# EAGLE board dev-board1 (EAGLE 9.0.1), part 1 of 2
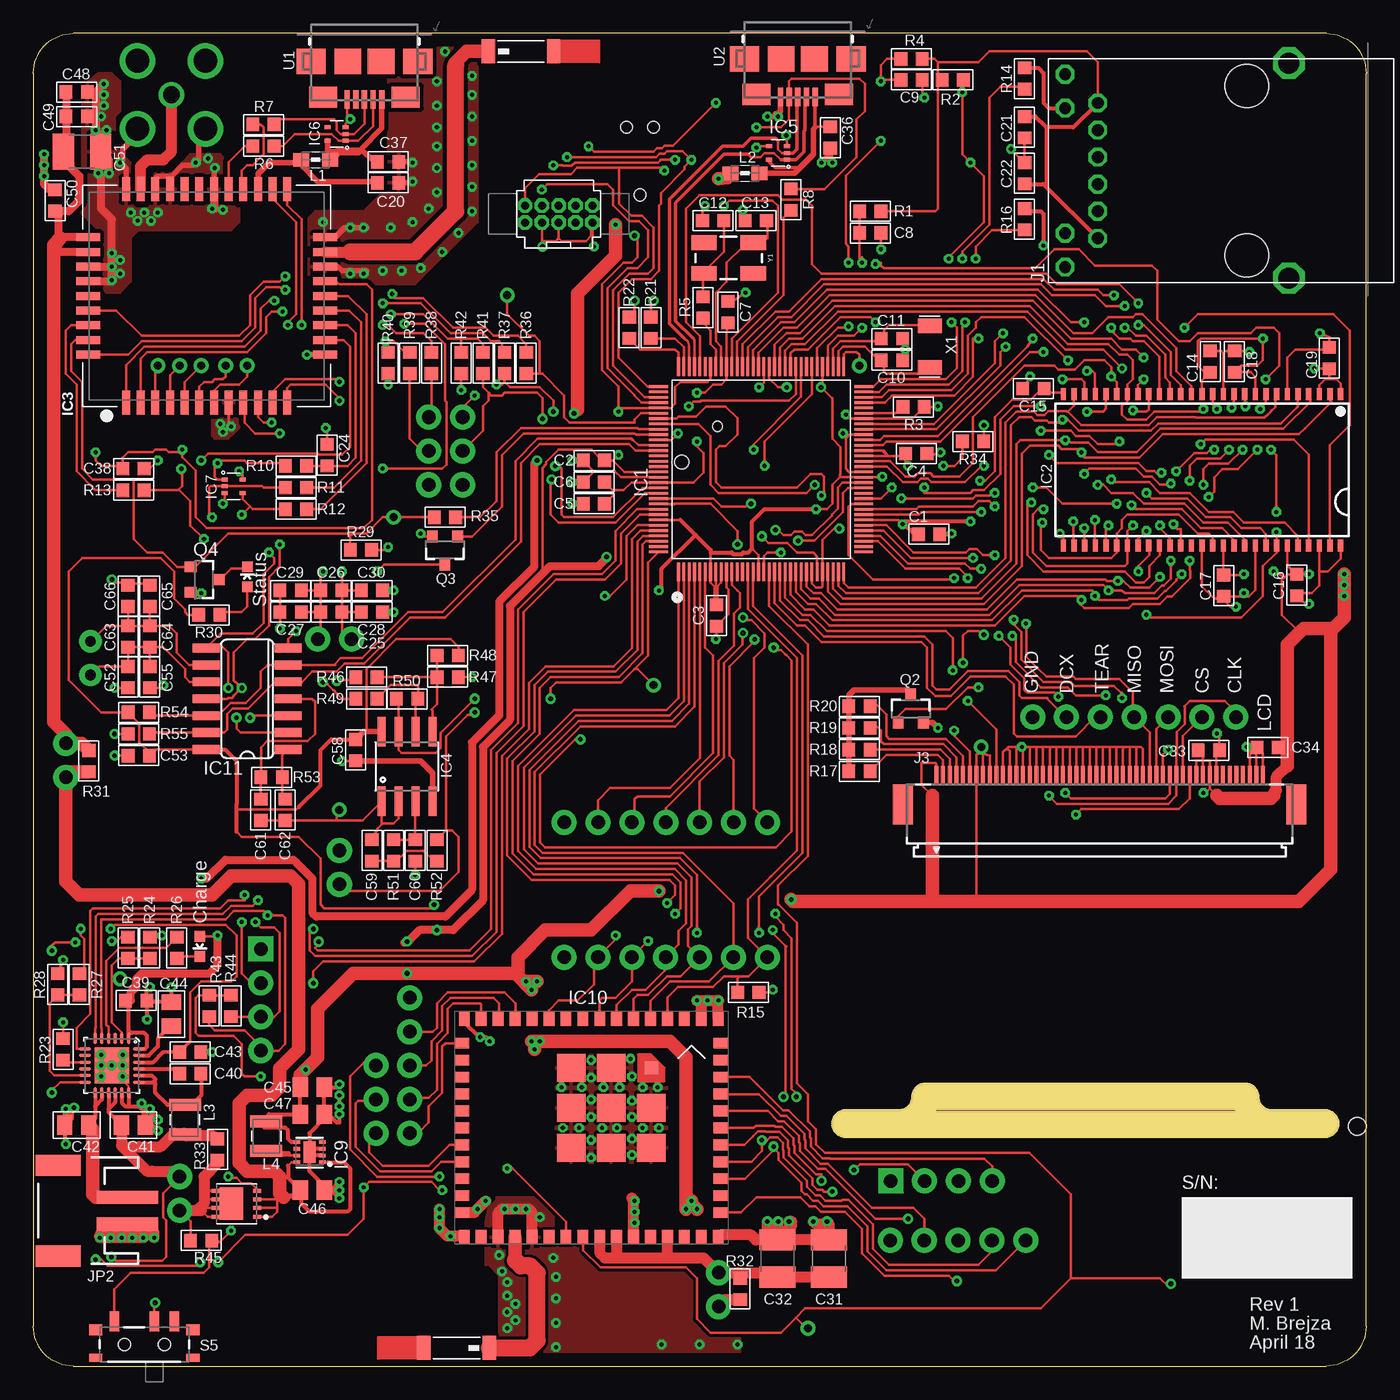
[diagram p3: board, top side]
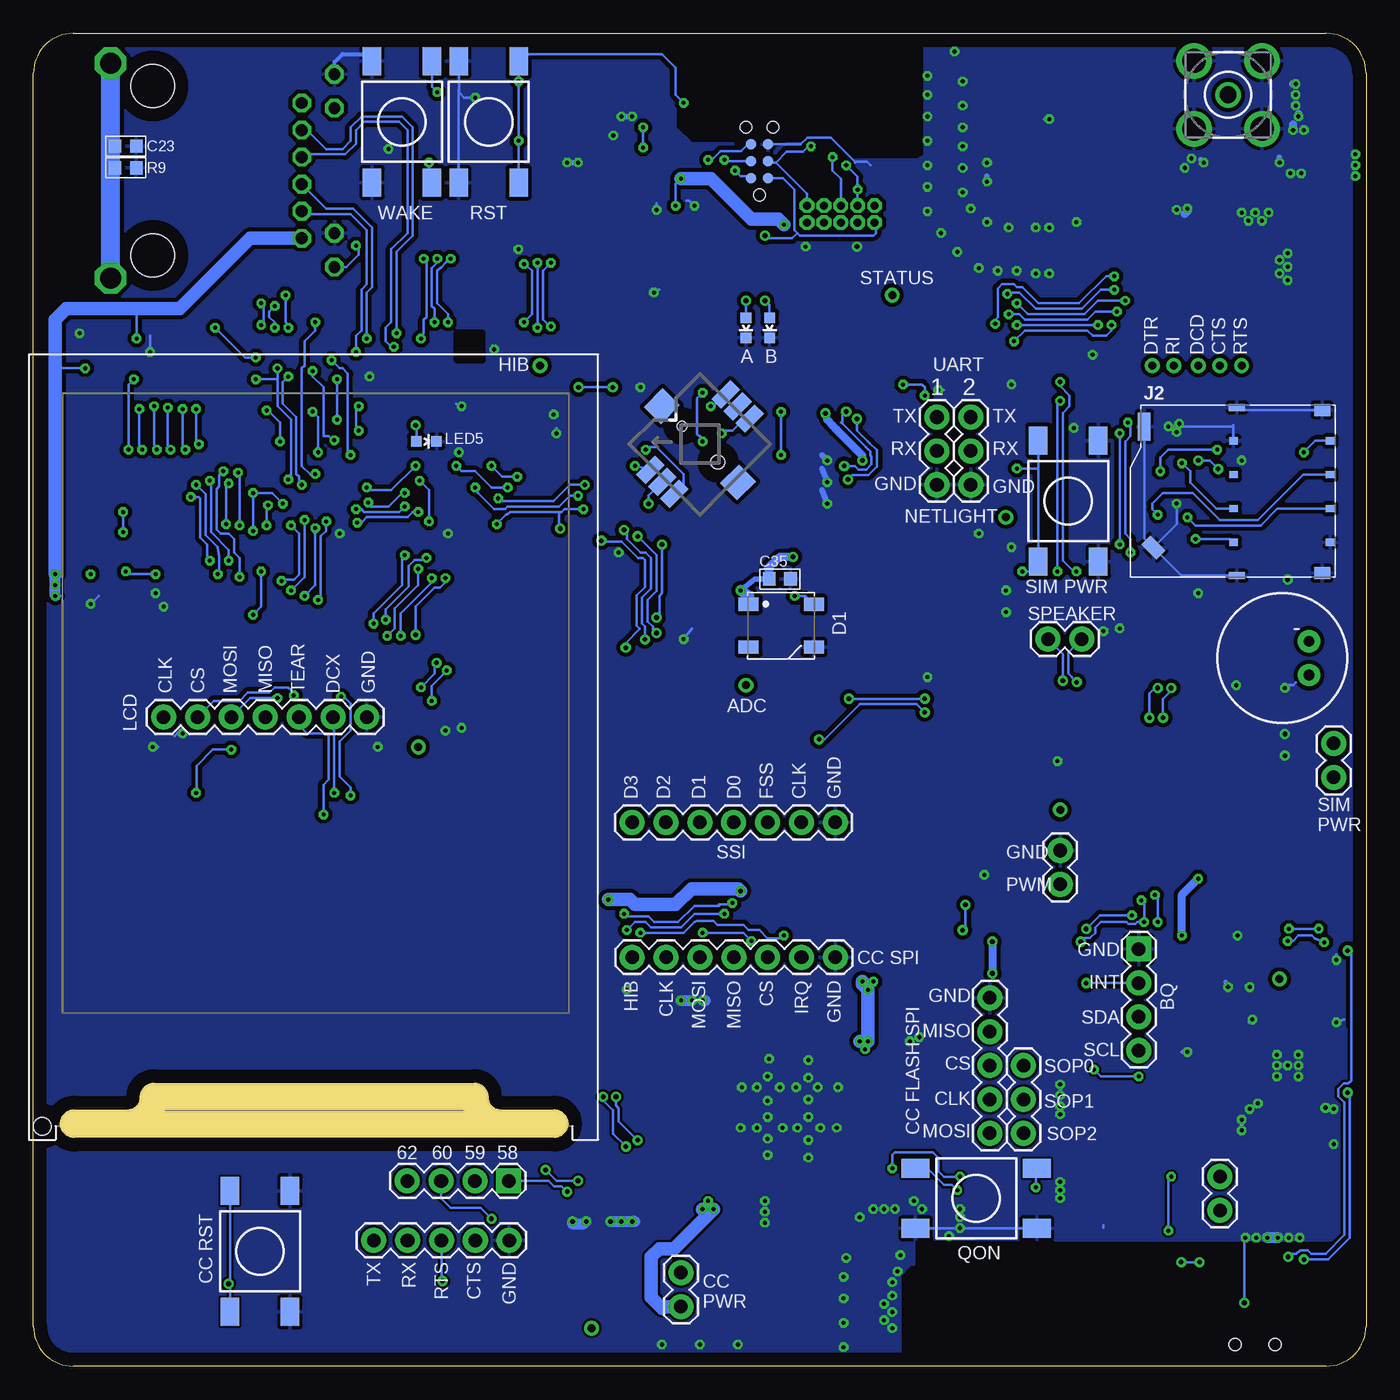
[diagram p4: board, bottom side, seen from below]

Size 100 x 100 mm. Coordinates in mm from the lower left corner, seen from the top.
Outline: 3,0 97,0 arc90 100,3 100,97 arc90 97,100 3,100 arc90 0,97 0,3 arc90 3,0
Copper layers (1*16): Top 0.035mm / dielectric 1.5mm / Bottom 0.035mm
Design rules "default *": minimum track width 7.5mil, minimum drill 12mil, track to track 7mil, track to pad 7mil, pad to pad 6mil, via to via 8mil, smd to smd 0.17271875mm, copper to edge 40mil, drill to drill 8mil, minimum pad ring 10mil, minimum via ring 8mil, stop-mask expansion 4mil, vias tented up to drill 14mil, thermal gap 10mil
Net classes: 0 default: width 0.15 mm, drill 0.3 mm

## Footprints (pad centres in the part's own frame; a part is rotated, then mirrored left to right if it is on the bottom)
2450AT42A100 = smd 1 x 1.8: P$1 -2.45,0; P$2 2.45,0
C0603-N = smd 0.95 x 1: 1 -0.8,0; 2 0.8,0
C1210 = smd 1.6 x 2.7: 1 -1.4,0; 2 1.4,0
C0805-N = smd 1.15 x 1.45: 1 -0.9,0; 2 0.9,0
WS2812B = smd 1.5 x 1: 1 -2.45,1.6; 2 -2.45,-1.6; 3 2.45,-1.6; 4 2.45,1.6
QFP128-0.4 = smd 0.2 x 1.4: 1 -6.2,-7.7; 2 -5.8,-7.7; 3 -5.4,-7.7; 4 -5,-7.7; 5 -4.6,-7.7; 6 -4.2,-7.7; 7 -3.8,-7.7; 8 -3.4,-7.7; 9 -3,-7.7; 10 -2.6,-7.7; 11 -2.2,-7.7; 12 -1.8,-7.7; 13 -1.4,-7.7; 14 -1,-7.7; 15 -0.6,-7.7; 16 -0.2,-7.7; 17 0.2,-7.7; 18 0.6,-7.7; 19 1,-7.7; 20 1.4,-7.7; 21 1.8,-7.7; 22 2.2,-7.7; 23 2.6,-7.7; 24 3,-7.7; 25 3.4,-7.7; 26 3.8,-7.7; 27 4.2,-7.7; 28 4.6,-7.7; 29 5,-7.7; 30 5.4,-7.7; 31 5.8,-7.7; 32 6.2,-7.7; 65 6.2,7.7; 66 5.8,7.7; 67 5.4,7.7; 68 5,7.7; 69 4.6,7.7; 70 4.2,7.7; 71 3.8,7.7; 72 3.4,7.7; 73 3,7.7; 74 2.6,7.7; 75 2.2,7.7; 76 1.8,7.7; 77 1.4,7.7; 78 1,7.7; 79 0.6,7.7; 80 0.2,7.7; 81 -0.2,7.7; 82 -0.6,7.7; 83 -1,7.7; 84 -1.4,7.7; 85 -1.8,7.7; 86 -2.2,7.7; 87 -2.6,7.7; 88 -3,7.7; 89 -3.4,7.7; 90 -3.8,7.7; 91 -4.2,7.7; 92 -4.6,7.7; 93 -5,7.7; 94 -5.4,7.7; 95 -5.8,7.7; 96 -6.2,7.7 | smd 1.4 x 0.2: 33 7.7,-6.2; 34 7.7,-5.8; 35 7.7,-5.4; 36 7.7,-5; 37 7.7,-4.6; 38 7.7,-4.2; 39 7.7,-3.8; 40 7.7,-3.4; 41 7.7,-3; 42 7.7,-2.6; 43 7.7,-2.2; 44 7.7,-1.8; 45 7.7,-1.4; 46 7.7,-1; 47 7.7,-0.6; 48 7.7,-0.2; 49 7.7,0.2; 50 7.7,0.6; 51 7.7,1; 52 7.7,1.4; 53 7.7,1.8; 54 7.7,2.2; 55 7.7,2.6; 56 7.7,3; 57 7.7,3.4; 58 7.7,3.8; 59 7.7,4.2; 60 7.7,4.6; 61 7.7,5; 62 7.7,5.4; 63 7.7,5.8; 64 7.7,6.2; 97 -7.7,6.2; 98 -7.7,5.8; 99 -7.7,5.4; 100 -7.7,5; 101 -7.7,4.6; 102 -7.7,4.2; 103 -7.7,3.8; 104 -7.7,3.4; 105 -7.7,3; 106 -7.7,2.6; 107 -7.7,2.2; 108 -7.7,1.8; 109 -7.7,1.4; 110 -7.7,1; 111 -7.7,0.6; 112 -7.7,0.2; 113 -7.7,-0.2; 114 -7.7,-0.6; 115 -7.7,-1; 116 -7.7,-1.4; 117 -7.7,-1.8; 118 -7.7,-2.2; 119 -7.7,-2.6; 120 -7.7,-3; 121 -7.7,-3.4; 122 -7.7,-3.8; 123 -7.7,-4.2; 124 -7.7,-4.6; 125 -7.7,-5; 126 -7.7,-5.4; 127 -7.7,-5.8; 128 -7.7,-6.2
TSOP54-400 = smd 0.4 x 0.9: 1 -10.4,-5.68; 2 -9.6,-5.68; 3 -8.8,-5.68; 4 -8,-5.68; 5 -7.2,-5.68; 6 -6.4,-5.68; 7 -5.6,-5.68; 8 -4.8,-5.68; 9 -4,-5.68; 10 -3.2,-5.68; 11 -2.4,-5.68; 12 -1.6,-5.68; 13 -0.8,-5.68; 14 0,-5.68; 15 0.8,-5.68; 16 1.6,-5.68; 17 2.4,-5.68; 18 3.2,-5.68; 19 4,-5.68; 20 4.8,-5.68; 21 5.6,-5.68; 22 6.4,-5.68; 23 7.2,-5.68; 24 8,-5.68; 25 8.8,-5.68; 26 9.6,-5.68; 27 10.4,-5.68; 28 10.4,5.68; 29 9.6,5.68; 30 8.8,5.68; 31 8,5.68; 32 7.2,5.68; 33 6.4,5.68; 34 5.6,5.68; 35 4.8,5.68; 36 4,5.68; 37 3.2,5.68; 38 2.4,5.68; 39 1.6,5.68; 40 0.8,5.68; 41 0,5.68; 42 -0.8,5.68; 43 -1.6,5.68; 44 -2.4,5.68; 45 -3.2,5.68; 46 -4,5.68; 47 -4.8,5.68; 48 -5.6,5.68; 49 -6.4,5.68; 50 -7.2,5.68; 51 -8,5.68; 52 -8.8,5.68; 53 -9.6,5.68; 54 -10.4,5.68
SIM800C = smd 1.8 x 0.6: 1 -8,6.05; 2 -8,4.95; 3 -8,3.85; 4 -8,2.75; 5 -8,1.65; 6 -8,0.55; 7 -8,-0.55; 8 -8,-1.65; 9 -8,-2.75; 10 -8,-3.85; 11 -8,-4.95; 12 -8,-6.05; 22 8,-6.05; 23 8,-4.95; 24 8,-3.85; 25 8,-2.75; 26 8,-1.65; 27 8,-0.55; 28 8,0.55; 29 8,1.65; 30 8,2.75; 31 8,3.85; 32 8,4.95; 33 8,6.05 | smd 0.6 x 1.8: 13 -4.4,-8.9; 14 -3.3,-8.9; 15 -2.2,-8.9; 16 -1.1,-8.9; 17 0,-8.9; 18 1.1,-8.9; 19 2.2,-8.9; 20 3.3,-8.9; 21 4.4,-8.9; 34 4.4,8.9; 35 3.3,8.9; 36 2.2,8.9; 37 1.1,8.9; 38 0,8.9; 39 -1.1,8.9; 40 -2.2,8.9; 41 -3.3,8.9; 42 -4.4,8.9
SO08 = smd 0.61 x 2.21: 1 -1.905,-2.616; 2 -0.635,-2.616; 3 0.635,-2.616; 4 1.905,-2.616; 5 1.905,2.616; 6 0.635,2.616; 7 -0.635,2.616; 8 -1.905,2.616
DRL-5 = smd 0.3 x 0.45: 1 -0.5,-0.675; 2 0,-0.675; 3 0.5,-0.675; 4 0.5,0.675; 5 -0.5,0.675
QFN-24 = smd 0.85 x 0.25: 1 -2.05,1.25; 2 -2.05,0.75; 3 -2.05,0.25; 4 -2.05,-0.25; 5 -2.05,-0.75; 6 -2.05,-1.25; 13 2.05,-1.25; 14 2.05,-0.75; 15 2.05,-0.25; 16 2.05,0.25; 17 2.05,0.75; 18 2.05,1.25 | smd 0.25 x 0.9: 7 -1.25,-2.025; 8 -0.75,-2.025; 9 -0.25,-2.025; 10 0.25,-2.025; 11 0.75,-2.025; 12 1.25,-2.025; 19 1.25,2.025; 20 0.75,2.025; 21 0.25,2.025; 22 -0.25,2.025; 23 -0.75,2.025; 24 -1.25,2.025 | smd 2.7 x 2.6: 25 0,0
WSON8 = smd 0.28 x 0.5: 1 -0.75,-0.95; 2 -0.25,-0.95; 3 0.25,-0.95; 4 0.75,-0.95; 5 0.75,0.95; 6 0.25,0.95; 7 -0.25,0.95; 8 -0.75,0.95 | smd 1.6 x 0.9: EP 0,0
CC3100MOD-LWK = smd 0.81 x 1.09: 1 -9.525,-8.2; 2 -8.255,-8.2; 3 -6.985,-8.2; 4 -5.715,-8.2; 5 -4.445,-8.2; 6 -3.175,-8.2; 7 -1.905,-8.2; 8 -0.635,-8.2; 9 0.635,-8.2; 10 1.905,-8.2; 11 3.175,-8.2; 12 4.445,-8.2; 13 5.715,-8.2; 14 6.985,-8.2; 15 8.255,-8.2; 16 9.525,-8.2; 28 9.525,8.2; 29 8.255,8.2; 30 6.985,8.2; 31 5.715,8.2; 32 4.445,8.2; 33 3.175,8.2; 34 1.905,8.2; 35 0.635,8.2; 36 -0.635,8.2; 37 -1.905,8.2; 38 -3.175,8.2; 39 -4.445,8.2; 40 -5.715,8.2; 41 -6.985,8.2; 42 -8.255,8.2; 43 -9.525,8.2 | smd 1.09 x 0.81: 17 9.7,-6.35; 18 9.7,-5.08; 19 9.7,-3.81; 20 9.7,-2.54; 21 9.7,-1.27; 22 9.7,0; 23 9.7,1.27; 24 9.7,2.54; 25 9.7,3.81; 26 9.7,5.08; 27 9.7,6.35; 44 -9.7,6.35; 45 -9.7,5.08; 46 -9.7,3.81; 47 -9.7,2.54; 48 -9.7,1.27; 49 -9.7,0; 50 -9.7,-1.27; 51 -9.7,-2.54; 52 -9.7,-3.81; 53 -9.7,-5.08; 54 -9.7,-6.35 | smd 1 x 1: 55 -4.5,-4.5 | smd 2.11 x 2.11: 56 -1.5,-4.5; 57 1.5,-4.5; 58 -4.5,-1.5; 59 -1.5,-1.5; 60 1.5,-1.5; 61 -4.5,1.5; 62 -1.5,1.5; 63 1.5,1.5
SO14 = smd 0.66 x 2.032: 1 -3.81,-3.073; 2 -2.54,-3.073; 3 -1.27,-3.073; 4 0,-3.073; 5 1.27,-3.073; 6 2.54,-3.073; 7 3.81,-3.073; 8 3.81,3.073; 9 2.54,3.073; 10 1.27,3.073; 11 0,3.073; 12 -1.27,3.073; 13 -2.54,3.073; 14 -3.81,3.073
RJMG163118101NR = drill 0.89 pad 1.3 octagon: 1 5.075,0; 2 3.045,0; 3 1.015,0; 4 -1.015,0; 5 -3.045,0; 6 -5.075,0; 7 7.23,2.45; 8 4.69,2.45; 9 -4.69,2.45; 10 -7.23,2.45 | drill 1.57 octagon: TAB1 8.065,-14.35; TAB2 -8.065,-14.35 | hole 3.25: 6.35,-11.18; -6.35,-11.18
MSIM-MOLEX = smd 0.65 x 0.55: C1 0.61,3.81; C2 0.61,1.27; C3 0.61,-1.27; C4 0.61,-3.81; C5 -6.65,3.81; C6 -6.65,1.27; C7 -6.65,-1.27; C8 -6.65,-3.81 | smd 1.2 x 0.89: GND1 0,6.125; GND2 0,-6.125 | smd 1.6 x 0.94 rotated 315: GND3 -12.67,-4.19 | smd 1.2 x 0.52: GND4 -6.39,6.31; GND5 -6.39,-6.31 | smd 0.94 x 2.1: GND6 -13.35,4.88
FH12-50S-0.5SH = smd 0.3 x 1.3: 1 -12.25,3.25; 2 -11.75,3.25; 3 -11.25,3.25; 4 -10.75,3.25; 5 -10.25,3.25; 6 -9.75,3.25; 7 -9.25,3.25; 8 -8.75,3.25; 9 -8.25,3.25; 10 -7.75,3.25; 11 -7.25,3.25; 12 -6.75,3.25; 13 -6.25,3.25; 14 -5.75,3.25; 15 -5.25,3.25; 16 -4.75,3.25; 17 -4.25,3.25; 18 -3.75,3.25; 19 -3.25,3.25; 20 -2.75,3.25; 21 -2.25,3.25; 22 -1.75,3.25; 23 -1.25,3.25; 24 -0.75,3.25; 25 -0.25,3.25; 26 0.25,3.25; 27 0.75,3.25; 28 1.25,3.25; 29 1.75,3.25; 30 2.25,3.25; 31 2.75,3.25; 32 3.25,3.25; 33 3.75,3.25; 34 4.25,3.25; 35 4.75,3.25; 36 5.25,3.25; 37 5.75,3.25; 38 6.25,3.25; 39 6.75,3.25; 40 7.25,3.25; 41 7.75,3.25; 42 8.25,3.25; 43 8.75,3.25; 44 9.25,3.25; 45 9.75,3.25; 46 10.25,3.25; 47 10.75,3.25; 48 11.25,3.25; 49 11.75,3.25; 50 12.25,3.25 | smd 1.5 x 3: 51 -14.75,1; 52 14.75,1
SWD_PTH_SHROUD = drill 0.6 octagon: 1 -2.54,-0.635; 2 -2.54,0.635; 3 -1.27,-0.635; 4 -1.27,0.635; 5 0,-0.635; 6 0,0.635; 7 1.27,-0.635; 8 1.27,0.635; 9 2.54,-0.635; 10 2.54,0.635
TC2030-MCP-NL = smd 0.787 x 0.787: 1 1.27,-0.635; 2 1.27,0.635; 3 2.54,-0.635; 4 2.54,0.635; 5 3.81,-0.635; 6 3.81,0.635 | hole 0.889: 0,0; 5.08,-1.016; 5.08,1.016
JST-2-SMD = smd 1 x 4.6: 1 -1,-3.7; 2 1,-3.7 | smd 1.6 x 3.4: NC1 -3.4,1.5; NC2 3.4,1.5
1X02 = drill 1.016 pad 1.88: 1 0,0; 2 2.54,0
1X07 = drill 1.016 pad 1.88: 1 0,0; 2 2.54,0; 3 5.08,0; 4 7.62,0; 5 10.16,0; 6 12.7,0; 7 15.24,0
1X04 = drill 1.016 pad 1.88 square: 1 0,0 | drill 1.016 pad 1.88: 2 2.54,0; 3 5.08,0; 4 7.62,0
1X05 = drill 1.016 pad 1.88: 1 0,0; 2 2.54,0; 3 5.08,0; 4 7.62,0; 5 10.16,0
1X03 = drill 1.016 pad 1.88: 1 0,0; 2 2.54,0; 3 5.08,0
JOYSTICK_MULTICOMP_NOSILK = smd 2 x 1: A -4,1.275; B 4,1.275; C -4,-1.275; COM 4,0; CTR -4,0; D 4,-1.275 | smd 2 x 1.8: NC 0,4.05; NC@0 0,-4.05 | hole 0.75: 0,1.9 | hole 1.05: 0,-1.9
WUERTH-0805 = smd 1.2 x 1: 1 -1.1,0; 2 1.1,0
1008 = smd 0.9 x 2.4: 1 -1.1,0; 2 1.1,0
LED-0603 = smd 0.8 x 0.8: A 0,-0.75; C 0,0.75
SOT23-3 = smd 0.8 x 0.9: 1 -0.95,-1; 2 0.95,-1; 3 0,1.1
Q3A = smd 0.3 x 0.6: 1 -0.975,-1.55; 2 -0.325,-1.55; 3 0.325,-1.55; 4 0.975,-1.55; 5 0.975,1.55; 6 0.325,1.55; 7 -0.325,1.55; 8 -0.975,1.55 | smd 2.45 x 1.775: EP 0,0.375
R0603-N = smd 0.95 x 1: 1 -0.8,0; 2 0.8,0
6MMTACTSM = smd 2.1 x 1.4: 1 -4.55,2.25; 2 4.55,2.25; 3 -4.55,-2.25; 4 4.55,-2.25
SWITCH-SPST-SMD-A = smd 0.7 x 1.5: 1 -2.25,-1.75; 2 -0.75,-1.75; 3 2.25,-1.75 | smd 1 x 0.6: GND1 -3.65,1; GND3 3.65,1 | smd 1 x 0.8: GND2 -3.65,-1.1; GND4 3.65,-1.1 | hole 0.9: -1.5,0; 1.5,0
TP = drill 0.6: P$1 0,0
USB-AB-MICRO-SMD_LWK = smd 1.4 x 0.4: D+ 2.85,0; D- 2.85,0.65; GND 2.85,-1.3; ID 2.85,-0.65; VBUS 2.85,1.3 | smd 1.6 x 2.1: SHIELD 2.675,3.1; SHIELD@5 2.675,-3.1 | smd 1.9 x 2: SHIELD@0 0,1.25; SHIELD@1 0,-1.25 | smd 1.9 x 2.2: SHIELD@2 0,-4; SHIELD@3 0,4
ER-TFT024-3 = hole 1.3: 1,1
MIC-9.7MM = drill 0.8 pad 1.676: 1 -2,1.27; 2 -2,-1.27
RESONATOR_EPSON_FC_145 = smd 1.1 x 1.8: P$1 -1.55,0; P$2 1.55,0
BU-SMA-V = drill 1.27: 1 0,0 | drill 1.778: 2 -2.55,2.55; 3 2.55,2.55; 4 2.55,-2.55; 5 -2.55,-2.55
CRYSTAL-SMD-5X3 = smd 1.9 x 1.1: 1 -1.85,-1.15; 2 1.85,-1.15; 3 1.85,1.15; 4 -1.85,1.15

## Placement (x,y rotation side)
ANT1  CHIPANT  [2450AT42A100]  31.75,1.37 180 top
ANT2  CHIPANT  [2450AT42A100]  36.58,98.64 0 top
C1  100n  [C0603-N]  67.21,62.42 0 top
C2  100n  [C0603-N]  42.06,67.96 180 top
C3  100n  [C0603-N]  51.26,56.32 270 top
C4  100n  [C0603-N]  66.24,68.46 0 top
C5  100n  [C0603-N]  42.06,64.7 180 top
C6  1u  [C0603-N]  42.06,66.33 180 top
C7  2.2u  [C0603-N]  52.12,79.08 90 top
C8  100n  [C0603-N]  62.79,85.02 0 top
C9  100n  [C0603-N]  65.89,96.5 0 top
C10  12p  [C0603-N]  64.41,75.47 0 top
C11  12p  [C0603-N]  64.41,77.1 0 top
C12  12p  [C0603-N]  51,85.94 180 top
C13  12p  [C0603-N]  54.2,85.94 180 top
C14  100n  [C0603-N]  88.29,75.37 90 top
C15  100n  [C0603-N]  75.03,73.34 180 top
C16  100n  [C0603-N]  94.79,58.61 270 top
C17  100n  [C0603-N]  89.31,58.56 270 top
C18  100n  [C0603-N]  90.12,75.37 90 top
C19  1u  [C0603-N]  97.23,75.63 90 top
C20  1u  [C0603-N]  26.62,88.78 180 top
C21  100n  [C0603-N]  74.37,92.95 90 top
C22  100n  [C0603-N]  74.37,89.49 270 top
C23  1n  [C0603-N]  93.07,91.53 180 bottom
C24  22p  [C0603-N]  22.05,68.36 270 top
C25  10p  [C0603-N]  22.35,56.58 180 top
C26  33p  [C0603-N]  22.35,58.2 180 top
C27  10p  [C0603-N]  19.3,56.58 180 top
C28  10p  [C0603-N]  25.4,56.58 180 top
C29  33p  [C0603-N]  19.3,58.2 180 top
C30  33p  [C0603-N]  25.4,58.2 180 top
C31  100u  [C1210]  59.69,8.08 90 top
C32  100u  [C1210]  55.83,8.08 90 top
C33  100n  [C0603-N]  88.19,46.21 180 top
C34  4.7u  [C0603-N]  92.61,46.41 0 top
C35  100n  [C0603-N]  43.99,59.07 0 bottom
C36  100n  [C0603-N]  59.79,92.19 270 top
C37  100n  [C0603-N]  26.62,90.36 0 top
C38  100n  [C0603-N]  7.52,67.35 0 top
C39  1u  [C0603-N]  7.72,27.43 0 top
C40  47n  [C0603-N]  11.79,21.95 180 top
C41  10u  [C0805-N]  7.52,18.08 0 top
C42  10u  [C0805-N]  3.25,18.08 180 top
C43  4.7u  [C0603-N]  11.79,23.57 0 top
C44  10u  [C0805-N]  10.36,26.42 90 top
C45  0805/10u/10V/X5R  [C0805-N]  20.93,20.93 0 top
C46  0805/10u/10V/X5R  [C0805-N]  20.93,13.21 0 top
C47  0805/10u/10V/X5R  [C0805-N]  20.93,18.9 0 top
C48  10p  [C0603-N]  3.25,95.59 180 top
C49  33p  [C0603-N]  3.25,93.76 180 top
C50  4.7u  [C0603-N]  1.63,87.46 270 top
C51  100u  [C1210]  3.66,91.12 0 top
C52  10p  [C0603-N]  7.11,51.7 270 top
C53  100n  [C0603-N]  7.92,45.81 0 top
C55  33p  [C0603-N]  8.74,51.7 270 top
C58  100n  [C0603-N]  24.18,46.21 270 top
C59  2.2n  [C0603-N]  25.4,38.69 90 top
C60  1n  [C0603-N]  28.65,38.69 90 top
C61  100n  [C0603-N]  17.07,41.74 90 top
C62  dnp  [C0603-N]  18.9,41.74 90 top
C63  33p  [C0603-N]  7.11,54.75 270 top
C64  10p  [C0603-N]  8.74,54.75 270 top
C65  10p  [C0603-N]  8.74,57.8 270 top
C66  33p  [C0603-N]  7.11,57.8 270 top
D1  [WS2812B]  43.89,55.56 0 bottom
IC1  MSP432E401  [QFP128-0.4]  54.61,67.29 0 top
IC2  MT48LC16M16A2  [TSOP54-400]  87.68,67.24 180 top
IC3  SIM800C  [SIM800C]  13,80.3 90 top
IC4  OPAMP-DUALU  [SO08]  28.04,44.99 0 top
IC5  TPD3E001DRL  [DRL-5]  55.88,91.02 90 top
IC6  TPD3E001DRL  [DRL-5]  22.76,92.44 90 top
IC7  TPD3E001DRL  [DRL-5]  15.04,66.02 270 top
IC8  BQ25601  [QFN-24]  5.89,22.56 270 top
IC9  TPS62082  [WSON8]  20.73,16.05 90 top
IC10  CC3120MOD  [CC3100MOD-LWK]  41.86,17.88 180 top
IC11  4066D  [SO14]  16.05,50.07 90 top
J1  MAGJACK-RJMG16XXX-8  [RJMG163118101NR]  79.86,89.7 90 top
J2  SIM-78723-1001  [MSIM-MOLEX]  3.3,65.62 0 bottom
J3  ER-TFT024-3  [FH12-50S-0.5SH]  80.01,41.13 0 top
J4  SWD_SHROUD  [SWD_PTH_SHROUD]  39.42,86.45 0 top
JP1  TC2030-SWDNL  [TC2030-MCP-NL]  45.52,87.87 90 bottom
JP2  [JST-2-SMD]  3.37,11.67 90 top
JP3  [1X02]  51.41,4.47 90 bottom
JP4  [1X02]  2.44,44.18 90 bottom
JP5  [1X02]  10.97,14.22 270 bottom
JP6  [1X07]  74.98,48.7 180 bottom
JP7  [1X07]  39.83,30.68 180 bottom
JP8  [1X04]  17.07,31.29 270 bottom
JP9  [1X05]  64.3,9.43 180 bottom
JP10  [1X04]  64.33,13.9 180 bottom
JP11  [1X03]  25.7,22.56 270 bottom
JP12  [1X05]  28.24,27.64 270 bottom
JP13  [1X03]  32.21,66.13 90 bottom
JP14  [1X03]  29.67,66.13 90 bottom
JP15  JOYSTICK_MINI_MULTICOM_NOSILK  [JOYSTICK_MULTICOMP_NOSILK]  49.99,69.17 45 bottom
JP16  [1X07]  39.83,40.8 180 bottom
JP17  [1X02]  22.96,38.69 270 bottom
JP18  [1X02]  21.34,54.54 180 bottom
L1  [WUERTH-0805]  21.18,90.51 180 top
L2  [WUERTH-0805]  53.39,89.49 0 top
L3  1.5u  [1008]  11.38,18.49 270 top
L4  SRN2512-2R2M  [1008]  17.48,17.27 90 top
LED1  green  [LED-0603]  46.53,77.91 180 bottom
LED2  red  [LED-0603]  44.75,77.91 180 bottom
LED3  red  [LED-0603]  12.5,31.5 180 top
LED4  red  [LED-0603]  16.05,59.22 0 top
LED5  red  [LED-0603]  70.51,69.38 270 bottom
Q2  [SOT23-3]  65.84,49.31 0 top
Q3  [SOT23-3]  30.89,61.25 180 top
Q4  [SOT23-3]  12.8,59.01 270 top
Q6  CSD25402Q3A  [Q3A]  15.24,12.19 90 top
R1  51  [R0603-N]  62.79,86.65 0 top
R2  1M  [R0603-N]  68.99,96.5 180 top
R3  4.87k  [R0603-N]  66.04,71.97 180 top
R4  10k  [R0603-N]  65.89,98.08 0 top
R5  2k  [R0603-N]  50.24,79.44 270 top
R6  22  [R0603-N]  17.27,91.53 180 top
R7  22  [R0603-N]  17.27,93.15 180 top
R8  10k  [R0603-N]  56.85,87.51 90 top
R9  1M  [R0603-N]  93.07,89.9 0 bottom
R10  51  [R0603-N]  19.71,67.55 0 top
R11  51  [R0603-N]  19.71,65.92 0 top
R12  51  [R0603-N]  19.71,64.3 0 top
R13  4.7k  [R0603-N]  7.52,65.72 0 top
R14  470  [R0603-N]  74.37,96.61 90 top
R15  100k  [R0603-N]  53.64,28.04 0 top
R16  470  [R0603-N]  74.37,86.04 90 top
R17  12  [R0603-N]  61.98,44.64 180 top
R18  12  [R0603-N]  61.98,46.26 180 top
R19  12  [R0603-N]  61.98,47.89 180 top
R20  12  [R0603-N]  61.98,49.51 180 top
R21  4k7  [R0603-N]  46.33,77.91 270 top
R22  2k  [R0603-N]  44.7,77.91 270 top
R23  2k  [R0603-N]  2.24,23.77 90 top
R24  dnp  [R0603-N]  8.74,31.39 90 top
R25  2k  [R0603-N]  7.11,31.39 270 top
R26  4.7k  [R0603-N]  10.77,31.39 90 top
R27  10k  [R0603-N]  3.45,28.65 270 top
R28  10k  [R0603-N]  1.83,28.65 90 top
R29  10k  [R0603-N]  24.59,61.25 180 top
R30  2k  [R0603-N]  13.21,56.37 180 top
R31  dnp  [R0603-N]  4.17,45.4 270 top
R32  dnp  [R0603-N]  53.04,5.79 270 top
R33  dnp  [R0603-N]  13.82,16.26 90 top
R34  2k  [R0603-N]  70.51,69.38 180 top
R35  1k  [R0603-N]  30.89,63.69 0 top
R36  1k  [R0603-N]  36.98,75.27 270 top
R37  1k  [R0603-N]  35.36,75.27 270 top
R38  1k  [R0603-N]  29.87,75.27 270 top
R39  1k  [R0603-N]  28.24,75.27 270 top
R40  5.6k  [R0603-N]  26.62,75.27 270 top
R41  1k  [R0603-N]  33.73,75.27 270 top
R42  5.6k  [R0603-N]  32.11,75.27 270 top
R43  4.7k  [R0603-N]  13.21,27.03 270 top
R44  4.7k  [R0603-N]  14.83,27.03 270 top
R45  10k  [R0603-N]  12.6,9.43 180 top
R46  10k  [R0603-N]  24.99,51.7 0 top
R47  22k  [R0603-N]  31.09,51.7 0 top
R48  22k  [R0603-N]  31.09,53.32 180 top
R49  10k  [R0603-N]  24.99,50.07 0 top
R50  10k  [R0603-N]  28.04,50.07 180 top
R51  14.7k  [R0603-N]  27.03,38.69 90 top
R52  7.87k  [R0603-N]  30.28,38.69 270 top
R53  10k  [R0603-N]  17.88,44.18 180 top
R54  10k  [R0603-N]  7.92,49.06 180 top
R55  10k  [R0603-N]  7.92,47.43 0 top
S1  [6MMTACTSM]  72.34,93.36 90 bottom
S2  [6MMTACTSM]  65.84,93.36 90 bottom
S3  [6MMTACTSM]  29.26,12.6 180 bottom
S4  [6MMTACTSM]  22.35,64.91 270 bottom
S5  CUS-12TB  [SWITCH-SPST-SMD-A]  8.33,1.63 180 top
S6  [6MMTACTSM]  82.99,8.62 270 bottom
TP1  TP  [TP]  6.5,29.06 270 top
TP2  TP  [TP]  58.12,2.84 90 top
TP3  TP  [TP]  35.56,80.35 90 top
TP4  TP  [TP]  27.03,63.69 90 bottom
TP7  TP  [TP]  61.98,75.07 90 top
TP8  TP  [TP]  71.12,46.46 90 top
TP9  TP  [TP]  9.35,75.07 0 top
TP10  TP  [TP]  10.97,75.07 90 top
TP11  TP  [TP]  12.6,75.07 90 top
TP12  TP  [TP]  16.05,75.07 90 top
TP13  TP  [TP]  14.43,75.07 90 top
TP14  TP  [TP]  46.53,51.09 0 bottom
TP15  TP  [TP]  22.96,41.74 0 bottom
U1  [USB-AB-MICRO-SMD_LWK]  24.84,97.88 270 top
U2  [USB-AB-MICRO-SMD_LWK]  57.35,98.08 270 top
U3  ER-TFT024-3-OUTLINE  [ER-TFT024-3]  100.33,17 0 bottom
U$1  MIC9.7MM  [MIC-9.7MM]  6.3,53.12 180 bottom
X1  [RESONATOR_EPSON_FC_145]  67.26,76.49 90 top
X2  BU-SMA-V  [BU-SMA-V]  10.36,95.39 0 bottom
Y1  [CRYSTAL-SMD-5X3]  52.17,83.14 0 top

## Tracks (layer width: path | path; a pad name or v marks a point on that pad's centre or on a via)
+3V3  (via drill 0.3, 0.35)
  Top 0.203: J3.9 71.76,45.82 71.53,45.85 71.26,45.99 | J3.8 71.26,45.99 | 71.26,45.99 70.76,45.9 J3.7 70.76,34.93 70.71,34.88 | IC1.26 58.41,58.72 58.73,58.41 59.13,58.41 59.21,58.48 IC1.28 59.21,61.97 60.23,62.99 60.38,62.84 v60.47,62.84 | 64.01,68.36 63.67,68.69 IC1.52 63.81,68.69 64.21,68.3 | IC1.51 64.21,68.3 | 64.21,68.3 65.41,68.3 C4.1 65.44,67.74 v65.63,67.55 | v63.7,66.74 63.66,66.69 IC1.47 60.51,66.69 | IC2.1 98.08,73.71 97.74,74.05 97.13,74.05 | IC2.3 96.48,73.61 96.93,74.05 97.13,74.05 | v96.11,74.86 96.69,74.83 C19.1 97.23,74.15 97.13,74.05 | C18.1 90.51,74.57 | IC2.9 91.68,74.22 91.33,74.57 90.51,74.57 | IC2.49 94.08,60.12 | 94.08,60.12 C16.1 94.07,59.41 93.88,59.22 | IC2.43 89.28,59.38 C17.1 90.77,59.36 v90.83,59.42 | 94.08,60.12 94.08,60.03 94.69,59.42 v95.71,59.42 | 77.28,72.9 IC2.27 77.17,73.03 76.14,73.03 75.97,73.21 | 75.97,73.21 C15.1 75.66,73.44 | IC1.79 55.21,74.11 55.88,73.44 v56.53,73.44 | R44.1 R43.1 12.38,27.83 12.19,27.63 12.19,24.99 12.39,24.79 15.04,24.79 15.65,24.18 15.65,21.95 15.85,21.74 v17.07,21.74 | R30.2 11.58,56.37 11.38,56.58 11.38,56.78 10.57,57.59 10.57,59.62 9.55,60.64 3.66,60.64 2.64,59.62 2.64,51.5 5.08,49.06 R54.2 7.95,48.24 7.95,46.81 8.72,46.03 C53.2 9.18,46.26 IC11.14 | J3.41 87.76,45.45 | 87.76,45.45 87.76,45.84 C33.2 | 87.76,45.45 88.19,45.45 88.26,45.38 J3.42 88.26,43.34 | J3.40 87.26,45.36 87.17,45.45 87.76,45.45 | J3.1 67.76,45.15 67.67,45.25 66.65,45.25 66.65,43.62 67.46,42.81 | 88.26,43.34 88.8,42.81 | R4.2 67.61,98.08 67.87,97.83 | 67.87,97.83 67.87,96.61 | 67.87,96.61 67.87,86.85 67.67,86.65 R1.2 | C34.2 94.03,46.41 94.08,46.46
  Top 0.203: 93.88,59.22 93.67,59.01 93.67,56.37 94.89,55.15 95.1,55.15 | v93.07,59.62 93.88,59.22 | J3.35 84.76,45.88 v85.14,46.26 | v87.78,43.01 87.92,43.01 88.26,43.34 | IC1.8 51.21,58.4 | IC1.9 51.61,58.8 51.21,58.4 | 90.51,74.57 90.63,74.66 90.42,74.86 90.63,75.07 91.85,75.07 92.25,75.47 v92.25,77.1 87.58,77.1 87.38,76.9 87.38,75.07 88.28,74.17 C14.1 87.68,73.96 IC2.14 | v71.02,66.43 71.42,66.43 72.14,67.14 72.14,71.21 73.47,72.53 74.83,72.53 75.5,73.21 75.97,73.21 | 93.88,48.7 94.08,48.5 | IC1.69 59.21,73.56 v59.09,73.44 59.91,72.63 59.94,72.63 59.94,69.58 60.55,68.97 60.55,66.94 60.51,66.9 60.51,66.69 | IC1.90 50.81,74.06 50.6,73.85 48.56,73.85 48.16,73.44 48.16,72.22 47.83,71.9 IC1.101 44.17,71.9 v43.89,71.61 43.89,73.51 42.67,74.73 42.67,81.16 44.3,82.79 44.91,82.79 45.31,83.19 45.31,84.82 v45.11,84.82 | TP8.P$1 71.12,46.13 71.26,45.99 | 40.13,68.77 40.14,68.76 | 40.14,68.76 41.86,68.76 42.67,67.95 C2.1 43.48,67.95 | 40.14,68.76 39.41,68.76 38.48,67.83 38.48,67.67 38.2,67.4 38.2,59.62 38.28,59.55 | 43.48,67.95 44.34,67.09 IC1.113 | v43.89,68.36 43.48,67.95 | 15.24,42.15 15.24,41.95 15.22,41.76 19.73,41.76 19.91,41.95 | R48.1 31.89,53.95 31.29,54.54 27.23,54.54 24.99,52.31 24.99,47.61 | 67.87,97.83 70.92,97.83 71.73,98.64 79.05,98.64 79.86,97.83 J1.1 | R2.2 67.97,96.5 67.87,96.61 | 60.51,66.69 59.94,66.13 59.94,64.7 59.54,64.3 v58.73,64.3 | 50.8,61.05 50.81,61.04 IC1.7 50.81,58.8 51.21,58.4 | IC1.122 48.55,63.49 48.56,63.48 | IC1.16 54.41,60.85 53.93,61.33 | 15.24,40.12 15.65,39.71 19.91,39.71 21.54,38.09 21.54,34.63 21.83,34.34 29.99,34.34 30.26,34.62 | 30.28,34.63 30.26,34.62
  Top 0.203: 30.26,34.62 v30.07,34.62 | IC1.39 64.91,63.49 v65.23,63.18
  Top 0.305: C45.1 C47.1 17.68,18.9 17.27,18.49 L4.2 17.36,17.88 18.9,17.88 19.1,17.68 19.1,17.07 19.37,16.8 IC9.5 | J1.1 78.03,92.95 76,92.95 | 76,92.95 75.18,93.76 75.17,93.75 C21.2 | J1.6 75.89,88.58 | 75.89,88.58 75.78,88.69 C22.2 | IC11.14 14.38,46.26 15.24,45.4 15.24,42.15 15.24,40.12 | 19.91,41.95 21.54,43.57 21.54,46.21 22.35,47.03 22.57,47.01 C58.1 | 76,92.95 76,88.68 75.89,88.58 | v58.73,64.3 54.84,64.3 53.93,63.38 53.93,61.33 53.65,61.05 53.26,61.05 53.14,60.92 52.53,60.92 52.4,61.05 50.82,61.05 50.81,61.04 50.81,61.24 49.68,62.37 | 48.55,63.49 49.68,62.37 | v46.94,58.2 47.14,58.41 47.14,59.83 49.68,62.37 | v70.31,63.38 65.43,63.38 65.28,63.23 | 65.28,63.23 v65.23,63.18 | C1.1 66.09,62.42 65.28,63.23
  Top 0.406: IC4.8 24.99,47.61 24.78,47.61 C58.1 | 51.21,58.4 51.21,57.17 C3.1
  Top 0.61: v43.01,60.72 v43.01,60.71 43.05,60.66 42.42,60.03 38.76,60.03 38.28,59.55 35.76,57.03 35.76,48.5 33.73,46.47 33.73,34.95 31.5,32.72 v30.28,32.72 28.97,32.72 28.04,31.79 27.84,31.79 27.91,31.86 v28.04,31.86
  Top 0.813: 93.07,42.81 93.07,43.01 93.27,43.21 93.27,44.23 94.08,45.04 | R32.2 51.93,4.99 JP3.1
  Top 1.016: C45.1 20.03,21.86 v20.42,22.25 21.34,23.16 21.34,26.82 23.98,29.46 v28.04,29.46 36.17,29.46 | 36.17,29.46 v37.39,28.24 | v37.39,24.38 37.8,24.38 | 37.8,24.38 47.75,24.38 48.97,23.16 v48.97,11.79 | 67.46,42.81 67.46,34.88 | 88.8,42.81 89,42.6 92.86,42.6 93.07,42.81 | 94.08,45.04 94.08,46.46 94.08,48.5 94.08,54.14 95.1,55.15 95.3,55.36 97.54,55.36 | 97.54,55.36 98.35,56.17 v98.35,57.8 v98.35,58.61 v98.35,59.42 | 36.17,29.46 36.37,29.67 36.37,30.68 38.41,32.72 41.86,32.72 44.79,35.65 v46.94,35.65 | 67.46,34.88 56.98,34.88 v56.86,35 | 67.46,34.88 70.71,34.88 94.94,34.88 97.33,37.27 97.33,55.15 97.54,55.36 | v36.98,28.85 v37.8,28.85 | v37.59,23.77 37.59,24.18 37.8,24.38 | v49.78,11.79 49.38,12.19 v49.38,12.39
  Bottom 0.203: v63.7,66.74 64.82,66.74 v65.63,67.55 | v95.71,59.42 95.5,59.42 95.5,59.62 | JP1.1 43.74,89.14 42.88,88.28 42.88,85.23 42.67,85.02 | 42.67,85.02 42.47,84.82 36.98,84.82 36.78,85.02 36.78,85.71 J4.1 | v90.83,59.42 93.27,59.42 v93.07,59.62 | v85.14,46.26 86.54,46.26 87.76,45.04 87.76,43.03 v87.78,43.01 | v17.07,21.74 19.91,21.74 v20.42,22.25 | v43.89,68.36 v43.89,71.61 | v92.25,77.1 92.25,79.33 | v96.11,74.86 97.74,74.86 98.35,75.07 | v70.31,63.38 70.31,65.72 v71.02,66.43 | 60.55,64.09 60.35,64.09 60.15,64.3 v58.73,64.3 | v45.11,84.82 44.91,84.62 43.08,84.62 42.67,85.02 | v56.53,73.44 v59.09,73.44 | v60.47,62.84 60.55,62.92 60.55,64.09 | v30.07,34.62 30.07,32.6 30.16,32.6 v30.28,32.72 | v65.23,63.18 64.52,63.89 64.45,63.89 64.25,64.09 60.55,64.09
  Bottom 0.406: C35.1 45.87,59.06 v46.94,58.2
  Bottom 0.61: v43.01,60.72 44.02,60.72 44.91,59.83 44.79,59.71 C35.1 | v28.04,31.86 v28.04,29.46 28.04,29.35
  Bottom 0.813: v98.35,57.8 v98.35,59.42 | D1.1 46.34,57.81 v46.94,58.2
  Bottom 1.016: v98.35,59.42 98.35,75.07 98.35,78.52 97.54,79.33 92.25,79.33 89,79.33 83.72,84.62 J1.6 | v46.94,35.65 | v46.94,35.65 47.11,35.81 50.63,35.81 51.82,34.63 54.86,34.63 55.23,35 v56.86,35 | JP3.1 52.72,4.47 52.83,4.35 53.65,5.17 53.65,8.21 53.03,8.82 51.93,8.82 v48.97,11.79 v49.78,11.79 | v37.8,28.85 37.8,28.65 v37.39,28.24 v37.39,24.38 v38,24.38
ADC  (via drill 0.35)
  Top 0.203: IC1.128 46.13,60.31 46.13,53.33 45.11,52.31 | 45.11,52.31 44.09,51.29 39.22,51.29 38.81,50.89 v38.81,50.07 | v33.12,50.07 30.56,47.51 30.56,46.38 30.19,46.01 27.64,46.01 27.41,46.24 IC4.7 27.41,49.91 R50.2 | TP14.P$1 45.31,52.31 45.11,52.31
  Bottom 0.203: v38.81,50.07 v33.12,50.07
BQ_INT  (via drill 0.3, 0.35)
  Top 0.203: JP8.2 16.36,28.75 15.65,29.46 v15.65,33.33 | v15.85,35.36 15.85,34.95 14.63,34.95 14.02,34.34 4.47,34.34 4.27,34.14 4.27,26.42 3.25,25.4 3.25,23.8 IC8.7 | IC1.124 45.54,62.7 44.91,62.06 44.91,53.9 43.52,52.51 38.44,52.51 37.19,51.26 37.19,50.89 37.19,47.8 35.15,45.77 35.15,32.43 33.09,30.36 21.74,30.36 21,29.62 v21,28.74
  Bottom 0.203: v15.65,33.33 15.65,35.15 v15.85,35.36 | v21,28.74 17.08,28.74 JP8.2
BQ_SCL  (via drill 0.3, 0.35)
  Top 0.203: IC8.5 5.14,25.34 5.08,25.4 5.08,33.53 14.43,33.53 15.04,34.14 17.27,34.14 v17.58,33.83 18.69,33.83 18.9,33.63 18.9,24.18 18.39,23.67 JP8.4 17.07,23.98 15.85,25.2 13.61,25.2 13.21,25.6 R43.2 | IC1.121 45.52,63.9 44.09,62.47 44.09,60.23 42.88,59.01 39.22,59.01 36.78,56.58 36.78,48.04 34.75,46.01 34.75,32.6 32.92,30.77 21.13,30.77 20.73,31.18 20.73,32.52 v21,32.8
  Bottom 0.203: v21,32.8 19.97,33.83 v17.58,33.83
BQ_SDA  (via drill 0.3, 0.35)
  Top 0.203: IC8.6 4.64,25.37 4.67,25.4 4.67,33.73 4.88,33.93 14.22,33.93 14.83,34.54 16.46,34.54 v16.87,34.95 | R44.2 15.25,26.21 JP8.3 18.09,26.21 18.49,26.62 18.49,32.51 18.09,32.92 17.07,32.92 v16.66,33.33 | IC1.120 45.31,64.3 43.69,62.67 43.69,60.44 42.67,59.42 39.01,59.42 36.37,56.78 36.37,48.25 34.34,46.21 34.34,32.8 32.72,31.18 21.34,31.18 21.13,31.38 21.41,31.66 v21.41,31.85
  Bottom 0.203: v16.87,34.95 16.66,34.75 v16.66,33.33 17.15,33.33 17.3,33.17 17.85,33.17 18,33.33 19.91,33.33 20.32,32.91 20.32,32.52 20.72,32.12 21.14,32.12 v21.41,31.85
CC_CLK
  Top 0.203: IC10.5 46.3,27.41 47.75,28.85 50.7,28.85 JP7.6 52.53,34.73 48.74,38.52 38.21,38.52 37.62,39.11 37.62,44.58 41.06,48.01 48.13,48.01 49.61,49.49 IC1.4
CC_CS  (via drill 0.3)
  Top 0.203: v46.13,31.9 JP7.3 44.91,28.85 43.69,27.63 42.67,27.63 42.49,27.46 IC10.8 | IC1.3 49.21,49.7 47.92,48.42 40.89,48.42 37.22,44.74 37.22,38.95 38.05,38.11 48.53,38.11 49.78,36.87 v49.78,32.51
  Bottom 0.203: v49.78,32.51 46.74,32.51 v46.13,31.9
CC_HIB
  Top 0.203: IC10.4 47.57,27.66 48.36,28.45 51,28.45 51.82,29.26 53.03,29.26 | 53.03,29.26 53.65,29.26 JP7.7 53.61,32.14 53.61,35 55.27,36.66 55.37,36.76 57.3,38.69 57.3,53.12 53.61,56.81 IC1.14 | R15.1 52.84,29.07 53.03,29.26
CC_IRQ  (via drill 0.3)
  Top 0.203: v43.69,32.31 43.69,32 JP7.2 42.06,30.38 42.06,28.65 40.84,27.43 39.42,27.43 38.68,26.7 IC10.11 | IC1.15 54.01,57.02 57.71,53.33 57.71,38.49 54.46,35.24 v54.46,32.51
  Bottom 0.203: v43.69,32.31 43.89,32.11 44.91,32.11 45.52,32.72 46.33,32.72 46.74,33.12 48.68,33.12 48.97,33.41 50.19,33.41 50.39,33.33 51.21,32.51 v54.46,32.51
CC_MISO
  Top 0.203: 47.55,30.79 JP7.4 | IC10.7 43.76,27.1 44.91,28.24 45.92,28.24 47.35,29.67 47.35,30.58 JP7.4 | IC1.1 48.41,50.12 47.52,49.23 40.55,49.23 36.37,45.05 36.37,38.64 37.71,37.3 48.13,37.3 48.97,36.46 48.97,33.21 48.4,32.64 48.4,31.64 JP7.4
CC_MOSI
  Top 0.203: IC10.6 45.03,27.56 45.31,27.84 46.13,27.84 47.55,29.26 48.56,29.26 JP7.5 49.12,31.55 49.12,32.79 49.38,33.04 49.38,36.66 48.33,37.71 37.88,37.71 36.81,38.78 36.81,44.91 40.72,48.82 47.72,48.82 48.81,49.91 IC1.2
CC_RST  (via drill 0.35)
  Top 0.203: IC1.18 55.21,57.04 58.12,54.14 58.12,38.29 55.88,36.05 55.88,34.63 55.92,34.59 55.95,34.59 57.3,33.24 57.3,21.22 58.12,20.41 58.12,18.37 58.74,17.75 58.74,16.66 59.39,16.01 59.94,16.01 59.96,15.99 74.72,15.99 77.83,12.89 77.83,6.59 | 77.83,6.59 75.59,4.35 57.91,4.35 57.2,3.64 | 77.83,6.59 84.53,6.59 85.14,5.98 v85.34,6.18 | 57.2,3.64 56.08,2.52 50.8,2.52 49.78,3.54 49.78,6.59 48.97,7.4 42.55,7.4 41.25,8.71 41.25,9.66 IC10.35 | TP2.P$1 58,2.84 57.2,3.64
  Bottom 0.203: S6.4 85.24,6.08 v85.34,6.18 85.24,6.28 S6.3
CC_RX  (via drill 0.3, 0.35)
  Top 0.203: IC1.126 45.96,61.9 45.72,61.66 45.72,53.49 43.93,51.7 38.81,51.7 38,50.89 38,47.43 35.97,45.4 35.97,38.47 37.54,36.9 47.96,36.9 48.56,36.29 48.56,34.34 v48.16,33.93 | v55.47,32.72 55.47,32.51 56.45,31.54 | 56.45,31.54 56.49,31.5 | 56.45,31.54 56.45,20.36 v56.29,20.2 | IC10.47 53.86,15.34 54.66,16.14 v54.66,16.95 55.05,16.95 55.26,17.16 55.83,17.16 56.23,16.76 56.23,16.23 56.3,16.16 56.3,15.65 58.04,13.91 58.04,13.45 58.68,12.82 59.04,12.82 59.44,12.41 60.63,12.41 60.71,12.48 61.16,12.48 62.99,10.65 62.99,8.79 64.18,7.61 70.92,7.61 71.92,8.61 JP9.4
  Bottom 0.203: v48.16,33.93 50.39,33.93 51.41,32.92 53.65,32.92 54.05,33.33 54.86,33.33 v55.47,32.72 | v54.66,16.95 56.08,18.37 56.08,19.36 56.29,19.56 v56.29,20.2
CC_TX  (via drill 0.3, 0.35)
  Top 0.203: IC1.125 45.75,62.3 45.31,61.86 45.31,53.73 43.69,52.11 38.61,52.11 37.59,51.09 37.59,47.64 35.56,45.6 35.56,38.3 37.37,36.49 47.72,36.49 48.16,36.05 48.16,35.36 v47.55,34.75 | v55.68,33.93 55.68,33.73 56.29,33.12 56.29,32.72 56.9,32.11 56.9,20.81 57.25,20.46 v57.25,20.2 | IC10.46 53.41,14.07 55.54,16.21 55.54,16.34 | 55.54,16.34 v55.54,16.48 | JP9.5 72.22,7.2 64.01,7.2 62.59,8.62 62.59,10.48 61.07,12 59.27,12 58.87,12.41 58.51,12.41 58.03,12.89 57.91,12.89 57.63,13.16 57.63,13.74 55.89,15.48 55.89,15.99 55.54,16.34
  Bottom 0.203: v47.55,34.75 47.55,34.63 48.56,34.63 48.56,34.54 50.39,34.54 51.61,33.33 53.44,33.33 53.85,33.73 55.47,33.73 v55.68,33.93 | v55.54,16.48 56.49,17.42 56.49,19.19 57.3,20 57.3,20.15 v57.25,20.2
ETHLED0  (via drill 0.3)
  Top 0.203: IC1.63 63.46,73.09 64.01,73.65 68.68,73.65 69.7,74.66 69.7,78.12 v69.9,78.32 | R14.1 74.18,96 72.54,96 71.73,95.18 71.73,85.63 69.7,83.6 v69.7,83.09
  Bottom 0.203: v69.9,78.32 69.9,79.33 70.1,79.54 70.1,82.38 69.6,82.89 | 69.6,82.89 69.49,82.99 | v69.7,83.09 69.6,82.99 69.6,82.89
ETHLED1  (via drill 0.3)
  Top 0.203: IC1.61 63.88,72.3 64.41,72.83 69.09,72.83 70.51,74.25 70.51,77.1 v70.92,77.1 | v70.71,83.09 70.71,84.01 71.93,85.23 74.36,85.23 R16.1
  Bottom 0.203: v70.92,77.1 70.92,77.3 70.71,77.51 70.71,78.52 70.51,78.72 70.51,82.99 v70.71,83.09
ETHLED2  (via drill 0.3)
  Top 0.203: IC1.43 63.59,65.09 v64.41,65.92 | v68.28,67.55 69.09,67.55 69.71,68.17 R34.2
  Bottom 0.203: v64.41,65.92 65.63,65.92 66.85,67.14 67.87,67.14 v68.28,67.55
GGGG  (via drill 0.3)
  Top 0.203: IC3.2 8.05,75.6 8.53,76.08 16.05,76.08 17.48,77.51 17.48,78.72 17.88,79.13 v18.69,79.13 | v26.82,78.93 29.26,78.93 31.09,77.1 32.11,77.1 | R41.1 33.73,76.69 33.33,77.1 32.11,77.1 | R42.1 32.11,77.1
  Bottom 0.203: v18.69,79.13 20.32,79.13 20.93,78.52 25.6,78.52 26.01,78.93 v26.82,78.93
GND  (via drill 0.3, 0.35)
  Top 0.152: IC8.18 7.14,20.98 6.5,21.63
  Top 0.203: IC7.3 14.36,64.84 v14.22,64.7 | C38.2 8.74,67.35 v9.35,67.95 | C24.1 22.05,70.29 v21.95,70.39 | IC1.48 61.21,67.09 60.96,67.35 60.96,69.58 61.27,69.9 | IC1.55 61.27,69.9 | v60.96,71.41 61.27,71.09 IC1.58 65.97,71.09 R3.1 67.82,71.97 v67.87,72.02 | 61.27,69.9 60.85,69.9 v60.76,69.99 | v54.46,73.44 54.81,73.79 IC1.80 | IC2.6 94.08,75.68 94.69,76.29 97.09,76.29 C19.2 97.23,77.2 v96.52,77.51 | IC2.12 89.28,76.01 | C14.2 89.12,76.17 89.28,76.01 | 89.28,76.01 89.45,76.17 C18.2 91.12,76.17 v91.24,76.08 | IC2.52 96.48,59.62 | 96.48,59.62 96.48,58.57 95.91,58 94.98,58 C16.2 95.42,57.19 v95.71,57.19 | IC2.54 98.08,60.58 97.13,59.62 96.48,59.62 | IC2.41 87.68,58.51 88.59,57.59 89.14,57.59 | 89.14,57.59 C17.2 90.83,57.76 | 90.83,57.76 91.2,57.76 91.68,58.24 IC2.46 | 89.14,57.59 89.2,57.59 89.81,56.98 v90.22,56.98 | v74.78,74.25 74.51,73.71 74.51,73.62 C15.2 | C7.2 52.12,79.64 v53.44,80.55 | C13.2 53,86.61 v53.24,86.75 | C12.2 50.2,86.87 v50.39,87.06 | C11.2 65.43,77.1 v65.43,76.29 65.43,75.47 C10.2 | C21.1 C22.1 74.37,90.31 v73.36,91.32 | R23.2 v2.23,25.81 | R28.2 v2.23,30.48 | R40.2 v26.62,73.65 | C52.2 v6.11,50.9 v6.1,50.89 | C55.2 9.56,50.9 v9.75,51.09 | IC3.8 14.65,70.68 v14.83,70.5 | Q4.2 11.8,57.98 v12.6,58 | C30.1 v27.03,58.2 | C28.1 v27.03,56.58 | v18.49,55.36 18.5,55.34 C27.2 C29.2 | R42.2 v32.11,73.24 | J3.43 88.76,45.98 C33.1 88.99,47.29 v88.8,47.48 | J3.6 70.26,46.11 69.09,47.28 v69.09,47.68 | Q3.2 29.28,62.25 v29.06,62.47 | 39.42,84.62 39.22,84.41 38.2,84.41 38.15,84.47 J4.3 38.15,84.06 v38.2,84.01 | J4.5 39.42,84.62 | 39.42,84.62 39.62,84.41 41.45,84.41 41.86,84.82 41.86,85.71 J4.9 41.96,84.11 v42.06,84.01
  Top 0.203: U1.GND 23.54,93.79 v23.77,93.56 23.43,93.22 IC6.3 | R15.2 55.27,28.04 v55.47,28.24 | IC5.3 56.55,92.27 v56.49,92.34 | C36.2 59.88,91.39 59.94,91.32 | C9.2 66.69,95.35 v66.85,95.18 | C8.2 63.59,83.82 v63.6,83.81 | J3.50 92.26,45.96 C34.1 | J3.48 91.26,45.86 | 91.26,45.86 C34.1 | J3.49 91.76,46.36 C34.1 | 91.26,45.86 91.26,46.24 v91.03,46.46 | J3.11 72.76,46.07 73.05,46.36 | 73.05,46.36 73.15,46.46 73.76,46.46 | 73.76,46.46 v74.17,46.46 | v74.17,46.46 74.78,46.46 | 74.78,46.46 75.39,46.46 | 75.39,46.46 75.59,46.46 | 75.59,46.46 76.4,46.46 | 76.4,46.46 76.81,46.46 | 76.81,46.46 77.22,46.46 | 77.22,46.46 77.83,46.46 | 77.83,46.46 78.23,46.46 | 78.23,46.46 78.64,46.46 | 78.64,46.46 79.25,46.46 | 79.25,46.46 79.65,46.46 | 79.65,46.46 80.26,46.46 | 80.26,46.46 80.67,46.46 | 80.67,46.46 81.28,46.46 | 81.28,46.46 81.89,46.46 | 81.89,46.46 82.3,46.46 | 82.3,46.46 82.7,46.46 | 82.7,46.46 83.11,46.46 83.26,46.31 J3.32 | J3.31 82.76,46.41 82.7,46.46 | J3.30 82.26,46.43 82.3,46.46 | J3.29 81.76,46.33 81.89,46.46 | J3.28 81.26,46.44 81.28,46.46 | J3.27 80.76,46.37 80.67,46.46 | J3.26 80.26,46.46 | J3.25 79.76,46.36 79.65,46.46 | J3.24 79.26,46.45 79.25,46.46 | J3.23 78.76,46.34 78.64,46.46 | J3.22 78.26,46.44 78.23,46.46 | J3.21 77.76,46.4 77.83,46.46 | J3.20 77.26,46.42 77.22,46.46 | J3.19 76.76,46.41 76.81,46.46 | J3.18 76.26,46.32 76.4,46.46 | J3.17 75.76,46.29 75.59,46.46 | J3.16 75.26,46.34 75.39,46.46 | J3.15 74.76,46.45 74.78,46.46 | J3.14 74.26,46.37 v74.17,46.46 | J3.12 73.26,46.15 73.05,46.36 | J3.13 73.76,46.46 | 51.41,55.76 51.4,55.76 C3.2 | R24.2 9.44,32.19 v9.65,32.31 | IC2.28 77.28,62.2 v77.01,62.47 | 24.99,82.18 v24.79,81.98 | C4.2 67.36,68.26 67.46,68.36 v68.07,68.56
  Top 0.203: R29.1 26.42,61.25 v26.62,61.45 | 45.03,12.47 v45.11,12.39 | IC11.7 19.13,54.57 v19.71,55.15 | C60.1 v28.65,36.87 | C58.2 24.17,45.4 v23.16,45.4 | C53.1 v6.1,45.81 5.89,45.81 | R55.1 v6.1,47.43 | 42.07,67.13 43.66,67.13 44.1,66.69 IC1.114 | 41.18,67.92 41.28,67.92 42.07,67.13 | 42.07,67.13 C6.2 | v32.92,51.7 R47.2 | C66.1 7,58.7 | 7,58.7 6.9,58.81 5.89,58.81 v5.89,59.01 | C65.1 8.63,58.7 7,58.7 | IC1.17 54.81,60.79 55.07,61.05 v56.08,61.05 | v24.79,85.43 24.99,85.43 | C3.2 52.15,56.41 52.15,58.27 52.01,58.41 IC1.10 | C3.2 51.26,54.59 v51.21,54.54 | S5.2 9.08,4.7 v9.14,4.76 | v90.83,58 90.83,57.76
  Top 0.254: C43.2 v13.41,23.57
  Top 0.305: C39.2 8.52,26.02 v8.53,26.01 | v10.36,28.45 C44.2 8.64,27.32 C39.2 | C39.2 8.52,28.64 v8.74,28.45 | IC8.17 6.64,19.77 6.91,19.51 7.11,19.51 | 7.11,19.51 7.92,19.51 8.33,19.1 8.33,18.98 8.33,18.58 8.33,18.17 C41.2 8.94,18.09 v9.35,17.68 | IC8.18 7.14,19.54 7.11,19.51 | v2.44,19.3 2.35,19.39 C42.2 2.35,16.75 v2.44,16.66 | v9.35,18.49 8.74,18.49 8.33,18.09 | IC9.3 20.98,16.3 IC9.EP | IC9.2 20.98,15.8 IC9.EP | IC9.EP 20.73,17.48 21.83,18.58 C47.2 C45.2 22.76,20.93 v22.96,21.13 | IC9.EP 20.73,14.63 21.83,13.53 C46.2 22.35,13.21 | 22.35,13.21 v22.96,13.82 | v22.96,13.21 22.35,13.21 | 22.35,13.21 v22.96,12.6 | v22.96,20.32 v22.96,19.51 | v22.96,18.9 22.96,18.29 22.76,18.29 21.95,19.1 21.95,18.9 | IC10.16 32.33,25.78 33.43,24.69 v33.53,24.69 33.93,24.69 v34.24,24.38 | C1.2 68.83,62.42 v68.89,62.47
  Top 0.406: IC3.21 22.64,84.7 23.37,85.43 24.99,85.43 | IC3.19 22.84,82.5 23.16,82.18 24.99,82.18 | IC3.13 20.54,75.9 v20.52,75.88 | C5.2 v40.44,64.7 | C6.2 v40.44,66.33 | C2.2 41.18,67.92 v40.44,67.95 | Q2.2 67.45,48.31 v67.87,47.89 | C20.1 28.35,88.78 v28.45,88.89 | C37.2 28.4,90.36 v28.45,90.31 | IC3.27 13.55,89.84 v13.61,89.9 | IC3.33 6.96,89.86 v6.5,90.31 6.71,90.51 6.71,91.32 7.81,92.43 | IC3.31 9.15,89.1 9.35,89.29 10.16,89.29 | 10.16,89.29 10.36,89.29 11.18,90.1 11.99,90.1 v12.19,90.31 12.39,90.51 12.39,91.93 12.91,92.45 | IC3.30 10.26,89.2 10.16,89.29 | U2.GND 56.05,94.14 55.88,93.97 55.68,93.97 v55.88,93.76 v55.07,93.76 | C36.2 59.79,90.36 v59.94,90.31 | v59.13,90.31 59.94,91.12 59.74,91.32 | C58.2 29.05,45.41 29.95,44.51 IC4.4 | v2.44,19.3 2.44,18.98 2.85,18.58 2.85,19.19 v3.05,19.39 | v8.13,19.71 8.33,19.51 8.33,18.98 | 8.33,18.58 8.33,18.9 v8.74,19.3 8.74,19.1 v9.35,18.49
  Top 0.61: C48.1 4.67,95.59 | 4.67,95.59 v5.28,96.2 | C49.1 v5.08,93.76 | 5.06,92.32 C51.2 5.47,90.7 | 5.06,92.32 v5.49,92.75 | v5.69,89.49 5.69,90.49 5.47,90.7 | 5.47,90.7 4.88,90.1 v4.88,89.49 5.08,89.29 5.08,86.85 5.89,86.04 5.89,82.38 | C50.1 1.23,88.26 0.81,88.68 v0.81,89.29 v0.81,90.1 v0.81,90.92 | IC3.37 5.72,81.4 | v5.89,81.47 5.89,82.38 | IC3.36 5.78,82.5 5.89,82.38 | 4.67,95.59 v4.67,92.75 4.67,92.7 5.06,92.32 | IC3.27 13.55,86.91 13.61,86.85 v13.41,86.85
  Top 0.813: IC10.38 45.03,12.47 44.91,12.6 | IC10.32 37.41,11.56 37.19,11.79 v36.98,11.79 35.15,11.79 34.87,11.51 IC10.30 | IC10.27 33.07,11.53 v33.93,12.39 | JP2.1 6.87,9.8 v6.62,9.64 6.42,9.84 6.42,10.25 v5.81,9.64 5.6,9.84 5.6,10.45 4.99,9.84 v4.99,9.64 v8.24,9.64 8.65,10.04 8.65,10.45 9.06,10.04 v9.06,9.64 | v7.43,9.64 8.24,10.65 | IC10.2 50.11,27.3 v49.78,27.43 v51.41,27.43 51.38,27.41 IC10.1 | IC10.28 32.33,9.73 32.31,9.75 31.07,9.75 30.48,10.35 v30.48,11.79 | C32.2 55.88,9.53 | 55.88,9.53 v55.88,10.86 | 55.88,9.53 56.9,10.54 56.9,10.86 v56.69,10.86 | v55.07,10.86 55.07,10.24 C32.2 | C31.2 59.33,9.83 59.33,10.65 58.73,10.65 v58.52,10.86 | v59.54,10.86 59.69,10.7 C31.2 | C31.2 C32.2 | C32.2 54.21,9.48 53.85,9.84 51.54,9.84 IC10.43
  Bottom 0.203: v14.22,64.7 14.22,63.18 J2.GND3 | J2.GND6 16.65,62.11 J2.GND3 | J2.GND5 13.85,59.31 J2.GND3 | J2.GND1 9.51,71.74 | J2.C5 9.95,70.6 10.05,70.5 v14.83,70.5 | v21.95,70.39 21.95,70.6 | v60.96,71.41 60.76,71.41 | v60.76,69.99 60.76,70.39 | v54.46,73.44 54.25,73.44 | v91.24,76.08 91.24,77.3 | v90.22,56.98 90.42,56.98 | 95.1,57.8 v95.71,57.19 | v53.44,80.55 53.65,80.76 53.03,80.76 | v53.24,86.75 53.24,87.26 | v50.39,87.06 50.19,87.26 50.6,87.26 50.8,87.46 51,87.46 | 19.71,10.36 19.71,10.57 | v2.23,25.81 1.63,26.01 | v2.23,30.48 2.23,30.89 | v26.62,73.65 26.42,73.65 | v6.1,50.89 5.89,51.09 5.49,51.09 5.28,51.29 | v9.75,51.09 9.75,51.29 | v27.03,58.2 27.23,58 | v32.11,73.24 31.7,73.24 | v88.8,47.48 88.8,47.68 89,47.68 89.41,47.28 | v69.09,47.68 69.09,47.89 | v29.06,62.47 28.85,62.67 | v42.06,84.01 41.86,84.01 | v23.77,93.56 24.18,93.56 | S3.1 S3.2 | v55.47,28.24 55.47,28.45 | v66.85,95.18 67.67,95.18 68.07,95.59 68.07,95.79 | 68.07,95.79 68.07,98.5 S2.2 | S2.1 68.09,95.78 68.07,95.79 | v63.6,83.81 63.4,83.81 | v67.87,72.02 68.07,72.02 68.28,72.22 | v91.03,46.46 90.63,46.46 | v51.21,54.54 50.6,55.36 | v9.65,32.31 9.55,32.51 | v77.01,62.47 77.01,62.67 | v68.07,68.56 68.28,68.56 | v73.36,91.32 73.36,91.53 73.15,91.73 | v26.62,61.45 26.62,61.66 | 38.35,90.38 38.35,90.31 | 38.35,90.38 40.16,92.19 41.93,92.19 42.44,91.68 JP1.5 | 38.35,90.38 37.46,90.38 37.19,90.1 | v2.44,19.3 2.96,19.3 v3.05,19.39 | v9.14,4.76 9.14,9.55 v9.06,9.64
  Bottom 0.254: v13.41,23.57 13.82,23.57
  Bottom 0.305: v8.53,26.01 8.74,25.81 | v10.36,28.45 10.57,28.85 | v8.74,28.45 8.74,28.65 | v2.44,16.66 2.44,16.46 | 9.35,17.48 v9.35,17.68 v9.35,18.49 | v22.96,13.82 v22.96,13.21 | v22.96,12.6 22.96,12.39 | v22.96,21.13 v22.96,20.32 | v22.96,19.51 v22.96,18.9 | J1.7 77.41,97.84 76.81,98.44 74.67,98.44 S1.2
  Bottom 0.406: v20.52,75.88 20.32,75.88 | v40.44,64.7 40.84,65.72 | v40.44,66.33 40.84,67.35 | v40.44,67.95 40.84,68.36 | v67.87,47.89 68.07,47.89 | v28.45,88.89 28.45,89.29 | v28.45,90.31 28.65,90.31 | v13.61,89.9 13.61,90.1 | v6.5,90.31 6.5,90.71 | v12.19,90.31 12.39,90.51 | v55.88,93.76 v55.07,93.76 | v59.94,90.31 v59.13,90.31
  Bottom 0.61: v5.28,96.2 5.49,96.2 | v5.08,93.76 5.08,93.97 | v5.49,92.75 5.49,93.15 | v13.41,86.85 13.41,86.65 13.61,86.45
  Bottom 0.813: v6.62,9.64 v7.43,9.64 | v49.78,27.43 49.58,27.43 | v51.41,27.43 v50.6,27.43 | v56.69,10.86 v55.07,10.86 54.86,10.86 | v58.52,10.86 58.73,10.65 59.54,10.65 v59.54,10.86
  other vias: 39.62,20.93 41.15,20.93 41.86,21.64 41.86,22.96 44.81,23.06 44.91,21.74 43.99,20.93 42.77,20.93 45.72,20.93 46.84,20.93 46.94,17.88 45.72,17.88 44.91,18.69 44.91,19.91 44.91,17.07 44.91,15.85 41.86,15.65 41.86,16.97 42.67,17.88 43.79,17.88 40.94,17.88 39.73,17.88 45.11,10.77 45.11,11.58 35.36,11.79 36.17,11.79 33.32,11.79 30.48,11.18 23.77,85.43 23.77,81.98 41.86,20.02 41.86,18.69 5.89,82.48 5.89,83.5 38,11.18 34.95,8.33 35.15,7.11 35.56,6.3 35.56,5.28 36.17,4.67 36.17,3.45 35.56,4.06 35.56,2.84 39.22,1.42 39.22,3.25 39.22,5.08 39.22,6.71 39.01,8.13 52.83,1.63 49.99,1.63 47.14,1.63 30.28,96.4 30.28,94.57 30.28,92.95 30.28,91.53 30.28,89.9 30.28,88.07 29.67,86.85 28.45,85.84 26.82,85.43 26.21,82.18 27.64,82.18 29.06,82.38 30.68,83.6 31.9,85.02 32.92,86.65 32.92,88.48 32.92,90.1 32.92,91.93 32.92,93.76 32.92,95.39 32.92,96.81 30.89,98.64 21.74,85.84 5.08,23.37 6.71,23.37 6.71,21.74 5.08,21.74 5.89,22.56 6.71,22.56 5.08,22.56 30.48,10.36 31.29,9.75 14.02,70.7 14.22,70.09 7.32,86.55 8.33,86.55 9.35,86.55 14.22,86.75 5.28,95.39 5.28,94.57 6.5,82.99 6.5,81.98 7.82,85.94 8.84,85.94 13.11,90.61
  pour Top (isolate 0.305): 39.42,23.37 46.53,23.37 47.55,22.35 47.55,15.65 47.14,15.24 39.83,15.24 39.22,15.85 39.22,22.76
  pour Bottom (isolate 0.305): -1.42,105.34 -1.42,22.03 112.78,16.14 112.78,113.07 8.33,113.07
  pour Bottom: 1.42,9.43 24.59,9.43 48.36,9.64 49.78,8.21 49.78,-0.52 50.39,-1.13 101.6,-1.13 101.6,19.39 102.01,19.8 1.83,25.69 -1.22,22.64 -2.03,9.64 -2.84,7.81 -1.63,7.4
  pour Top (isolate 0.203): 34.14,11.87 34.75,12.48 34.75,12.68 38,12.68 38.81,11.87 38.81,11.67 39.01,11.47 39.01,9.43 43.48,9.43 44.7,8.21 52.02,8.21 53.04,7.2 53.04,-0.12 52.63,-0.52 34.95,-0.52 34.95,6.79 34.14,7.6 33.93,7.6 33.93,10.86
  pour Bottom: 34.14,11.87 34.75,12.48 34.75,12.68 38,12.68 38.81,11.87 38.81,11.67 39.01,11.47 39.01,9.43 43.48,9.43 43.48,9.84 50.8,9.84 53.04,7.2 53.04,-0.12 52.63,-0.52 34.95,-0.52 34.95,6.79 34.14,7.6 33.93,7.6 33.93,10.86
  pour Top (isolate 0.305): 20.52,81.16 28.65,81.16 33.32,85.84 33.32,100.26 28.24,100.26 26.62,98.64 26.62,88.48 24.79,86.65 21.13,86.65 19.91,85.43 19.91,82.18 19.71,81.98
  cutout Top: 35.15,8.82 37.19,8.82 37.19,11.47 35.15,11.47
  pour Top (isolate 0.305): 15.24,70.19 15.44,70.39 15.44,73.24 15.04,73.64 13.82,73.64 13.41,73.24 13.41,69.78 13.61,69.58 14.63,69.58 15.04,69.99
  pour Top (isolate 0.305): 4.88,97.01 5.89,97.01 6.5,96.4 6.5,94.17 6.1,93.76 6.1,91.53 7.32,90.31 7.32,87.26 7.72,86.85 8.53,86.85 8.94,87.26 8.94,89.29 9.14,89.49 9.35,89.49 10.36,89.49 11.18,90.31 11.79,90.92 13,90.92 14.02,90.92 14.43,90.51 14.43,87.46 14.83,87.06 15.04,87.06 15.24,86.85 15.44,86.85 15.44,85.84 14.83,85.23 7.92,85.23 7.32,84.62 7.32,81.37 6.5,80.55 5.49,80.55 5.08,80.96 4.88,81.16 4.88,85.23 3.66,86.45 3.66,96
JOYC  (via drill 0.35)
  Top 0.203: IC1.118 51.02,65.09 51.61,64.5 53.44,64.5 53.65,64.7 v53.85,64.7
  Bottom 0.203: v53.85,64.7 53.85,65.31 JP15.CTR
JOYD  (via drill 0.3)
  Top 0.203: IC1.107 47.87,69.5 v48.36,69.99
  Bottom 0.203: JP15.D 46.64,71.1 47.55,70.19 48.16,70.19 v48.36,69.99
JOYL  (via drill 0.3)
  Top 0.203: IC1.73 57.61,72.73 53.85,68.97 54.05,68.97 v54.05,68.77
  Bottom 0.203: 51.51,65.62 JP15.C 51.21,66.15 51.21,66.94 53.24,68.97 53.85,68.97 v54.05,68.77 54.05,68.56
JOYR  (via drill 0.3)
  Top 0.203: IC1.74 57.21,72.94 56.69,72.43 50.11,72.43 50.06,72.38 49.53,72.38 v49.17,72.02
  Bottom 0.203: 47.88,72.9 JP15.B 48.95,72.02 v49.17,72.02
JOYU  (via drill 0.3)
  Top 0.203: v54.86,67.55 54.86,69.38 58.41,72.92 IC1.71
  Bottom 0.203: JP15.A 53.34,67.25 v54.86,67.55
LCD_BLIGHT  (via drill 0.3, 0.35)
  Top 0.203: 64.82,48.29 64.82,48.7 65.43,49.31 68.48,49.31 70.1,50.93 v70.92,50.93 | v69.09,59.12 68.99,59.01 62.99,59.01 61.15,60.85 61.16,60.86 61.16,64.5 61.36,64.69 IC1.42 | v69.75,52.77 69.75,54.8 70.1,55.15 70.92,55.15 71.19,54.88 v71.32,54.88
  Top 0.406: Q2.1 64.84,48.31 64.82,48.29
  Bottom 0.203: v69.09,59.12 69.09,58.81 69.49,58.41 69.9,58.41 71.32,56.98 v71.32,54.88 71.12,54.95 | v70.92,50.93 69.9,51.95 69.9,52.72 69.85,52.77 v69.75,52.77
LCD_CLK  (via drill 0.3)
  Top 0.203: IC1.35 63.36,61.9 65.43,59.83 69.49,59.83 70.1,59.22 v70.1,59.12 70.31,59.12 | v76.2,42.81 76.81,42.2 85.14,42.2 85.76,42.82 J3.37 85.76,45.95 85.8,45.99 85.8,47.6 86.39,48.18 86.39,49.54 | 86.36,49.51 86.39,49.54 | 86.39,49.54 86.77,49.92 89.41,49.92 90.02,49.31 90.02,48.9 JP6.7 | v76.91,50.22 76.61,50.53 74.57,50.53 74.37,50.73 74.37,51.58 73.3,52.65 73.3,53.93 v72.44,54.8
  Bottom 0.203: v70.1,59.12 70.1,58.81 72.44,56.47 v72.44,54.8 | v76.2,42.81 76.2,43.42 77.01,44.23 77.01,46.87 76.2,47.68 76.2,49.72 76.61,50.12 v76.91,50.22
LCD_CS  (via drill 0.3)
  Top 0.203: IC1.36 63.57,62.3 65.63,60.23 69.9,60.23 70.31,59.83 v71.12,59.83 | v80.47,50.33 78.23,50.33 77.62,50.93 75.59,50.93 73.71,52.81 73.71,54.54 v73.46,54.8 | J3.38 86.26,47.28 JP6.6
  Bottom 0.203: v80.47,50.33 80.67,50.73 80.87,50.93 81.89,50.93 82.3,50.53 83.92,50.53 84.53,49.92 86.46,49.92 JP6.6 | v73.46,54.8 72.9,55.35 72.9,56.83 71.12,58.61 v71.12,59.83
LCD_DCX  (via drill 0.3)
  Top 0.203: IC1.20 56.01,57.46 57.51,55.97 58.12,55.97 59.33,54.75 66.85,54.75 67.46,54.14 67.46,51.05 67.75,50.77 68.72,50.77 70.1,52.15 73.15,52.15 73.97,51.34 73.97,50.33 74.17,50.12 76,50.12 | J3.36 85.26,42.93 84.94,42.6 77.83,42.6 v77.42,43.01 | 76,50.12 76.1,50.12 | 76,50.12 77.42,48.7 JP6.2
  Bottom 0.203: v77.42,43.01 77.42,48.6 JP6.2
LCD_MISO  (via drill 0.3)
  Top 0.203: IC1.38 63.99,63.09 66.04,61.05 69.98,61.05 70.24,61.3 70.78,61.3 71.24,60.84 v72.14,60.84 | J3.33 83.76,47.54 JP6.4 82.5,48.8 82.5,50.53 81.48,51.54 78.23,51.54 78.03,51.75 76,51.75 75.39,52.36 74.52,53.22 74.52,55.66 v74.47,55.71
  Bottom 0.203: v72.14,60.84 72.14,61.05 72.34,60.84 72.34,58.61 74.47,56.47 v74.47,55.71
LCD_MOSI  (via drill 0.3)
  Top 0.203: IC1.37 63.78,62.7 65.84,60.64 v70.51,60.64 | J3.34 84.26,47.82 JP6.5 | v81.69,50.12 81.69,50.53 81.58,50.53 81.08,51.04 78.13,51.04 77.83,51.34 75.79,51.34 74.12,53.02 74.12,55.07 73.56,55.63 v73.56,56.01
  Bottom 0.203: v81.69,50.12 83.72,50.12 JP6.5 | v70.51,60.64 70.66,60.49 71.39,60.49 71.83,60.05 71.83,58.51 73.56,56.78 v73.56,56.01
LCD_RST  (via drill 0.3)
  Top 0.203: IC1.21 56.41,57.67 57.71,56.37 58.32,56.37 59.54,55.15 68.48,55.15 68.99,54.65 v68.99,52.21 | J3.10 72.26,47.76 v70.1,49.92
  Bottom 0.203: v70.1,49.92 70.1,51.04 69.08,52.07 69.08,52.12 v68.99,52.21
LCD_TEAR  (via drill 0.3)
  Top 0.203: IC1.19 55.61,57.25 57.3,55.56 57.91,55.56 59.13,54.34 66.65,54.34 67.06,53.93 67.06,50.89 67.67,50.28 68.84,50.28 70.31,51.75 72.95,51.75 73.56,51.14 73.56,47.48 73.79,47.25 78.21,47.25 79.65,48.7 JP6.3 | J3.39 86.76,42.6 85.95,41.79 78.64,41.79 v78.23,41.38
  Bottom 0.203: v78.23,41.38 78.23,43.62 77.83,44.03 77.83,47.28 78.03,47.48 79.45,47.48 79.86,47.89 79.86,48.5 JP6.3
LEDA
  Top 0.203: IC1.95 48.81,76.45 48.15,77.11 R21.2
LEDB
  Top 0.203: IC1.96 48.41,76.03 48.16,76.29 45.53,76.29 R22.2
MUX_A
  Top 0.203: R54.1 8.98,48.8 IC11.12 13.85,48.8 14.79,49.74 15.92,49.74 17.07,50.89 17.07,52.11 17.58,52.61 IC11.6 22.55,52.61 | IC1.108 45.39,69.09 45.01,69.48 | 45.01,69.48 45,69.49 | 45.01,69.48 44.97,69.48 44.87,69.58 37.83,69.58 36.17,67.92 36.17,62.03 30.72,56.58 28.11,56.58 24.66,53.12 23.06,53.12 22.55,52.61 | 22.55,52.61 22.66,52.61
MUX_B
  Top 0.203: IC11.5 19.07,51.29 | 19.07,51.29 18.09,51.29 16.13,49.33 14.96,49.33 14.56,48.93 14.56,47.77 14.33,47.53 IC11.13 8.83,47.53 R55.2 | IC1.109 45.18,68.69 44.7,69.17 38,69.17 36.58,67.75 36.58,61.86 30.89,56.17 28.28,56.17 27.48,55.37 24.82,52.72 23.37,52.72 22.76,52.11 20.93,52.11 20.12,51.29 19.07,51.29
N$1
  Top 0.203: IC1.89 51.21,76.28 50.8,76.69 50.8,77.71 50.19,78.32 50.19,78.59 R5.2
N$2  (via drill 0.3)
  Top 0.203: C7.1 52.01,77.38 IC1.87 52.01,74.04 51.61,73.65 51,73.65 50.39,73.03 v49.78,73.03 | 49.74,69.09 49.76,69.18 | 49.76,69.18 v49.78,69.38 | 49.76,69.18 49.76,69.04 50.29,68.51 50.29,67.03 49.55,66.3 IC1.115 44.87,66.3 44.3,65.72 43.48,65.72 | 42.9,66.3 C6.1 43.47,65.72 43.48,65.72 | C5.1 43.48,65.33 43.48,65.72
  Bottom 0.203: v49.78,69.38 49.95,69.7 | 49.95,69.7 49.99,69.78 | v49.78,73.03 50.19,72.63 50.19,69.95 49.95,69.7
N$3
  Top 0.305: IC8.13 4.64,19.51 | 4.64,19.51 4.64,18.58 C42.1 | IC8.14 5.14,20.01 4.64,19.51
  Top 0.813: 4.06,18 C42.1
  Top 1.016: JP2.2 4.69,12.67 4.47,12.89 4.47,17.77 C42.1
N$4
  Top 0.203: R5.1 50.24,81.87 Y1.1 50.21,81.99 51.82,83.6 51.82,85.52 C12.1
N$5
  Top 0.203: IC1.88 51.61,76.49 51.21,76.9 51.21,80.55 52.02,81.37 52.02,82.79 53.24,84.01 53.53,84.01 Y1.3 54.74,84.29 55.07,84.62 55.07,85.47 C13.1
N$6
  Top 0.203: IC1.66 60.41,76.14 60.76,76.49 62.38,76.49 62.99,75.88 63.01,75.88 C10.1 63.8,75.46 63.8,74.66 64.01,74.46 67.46,74.46 67.74,74.74 X1.P$1
N$7  (via drill 0.3)
  Top 0.203: IC1.68 59.61,76.56 60.35,77.3 61.57,77.3 v62.18,77.91 | 62.18,83.19 v62.18,82.79 61.99,82.98 C8.1 R1.1
  Bottom 0.203: v62.18,77.91 v62.18,82.79
N$8
  Top 0.203: IC1.67 60.01,76.35 60.55,76.9 63.4,76.9 63.41,76.91 63.41,77.3 C11.1 63.8,77.11 63.8,77.71 64.21,78.12 66.65,78.12 66.93,77.84 X1.P$2
N$9  (via drill 0.3)
  Top 0.203: IC1.64 63.05,73.5 63.6,74.05 68.48,74.05 69.29,74.86 69.29,77.91 v68.89,78.32 | R2.1 69.7,96.42 v69.7,95.59 69.7,90.92 v70.31,90.31 71.32,89.29 71.32,85.84 68.68,83.19 v68.68,83.09